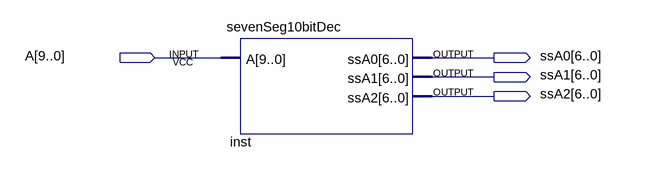
[diagram p0: schematic sheet]
// Quartus schematic testSevenSeg10bitDec.bdf as structural Verilog: 1 symbols, 4 pins
module testSevenSeg10bitDec (
  input  [9:0] A,
  output [6:0] ssA0,
  output [6:0] ssA1,
  output [6:0] ssA2
);

  sevenSeg10bitDec inst (.A(A), .ssA0(ssA0), .ssA1(ssA1), .ssA2(ssA2));
endmodule
